# EAGLE schematic generator2 (EAGLE 6.5.0)
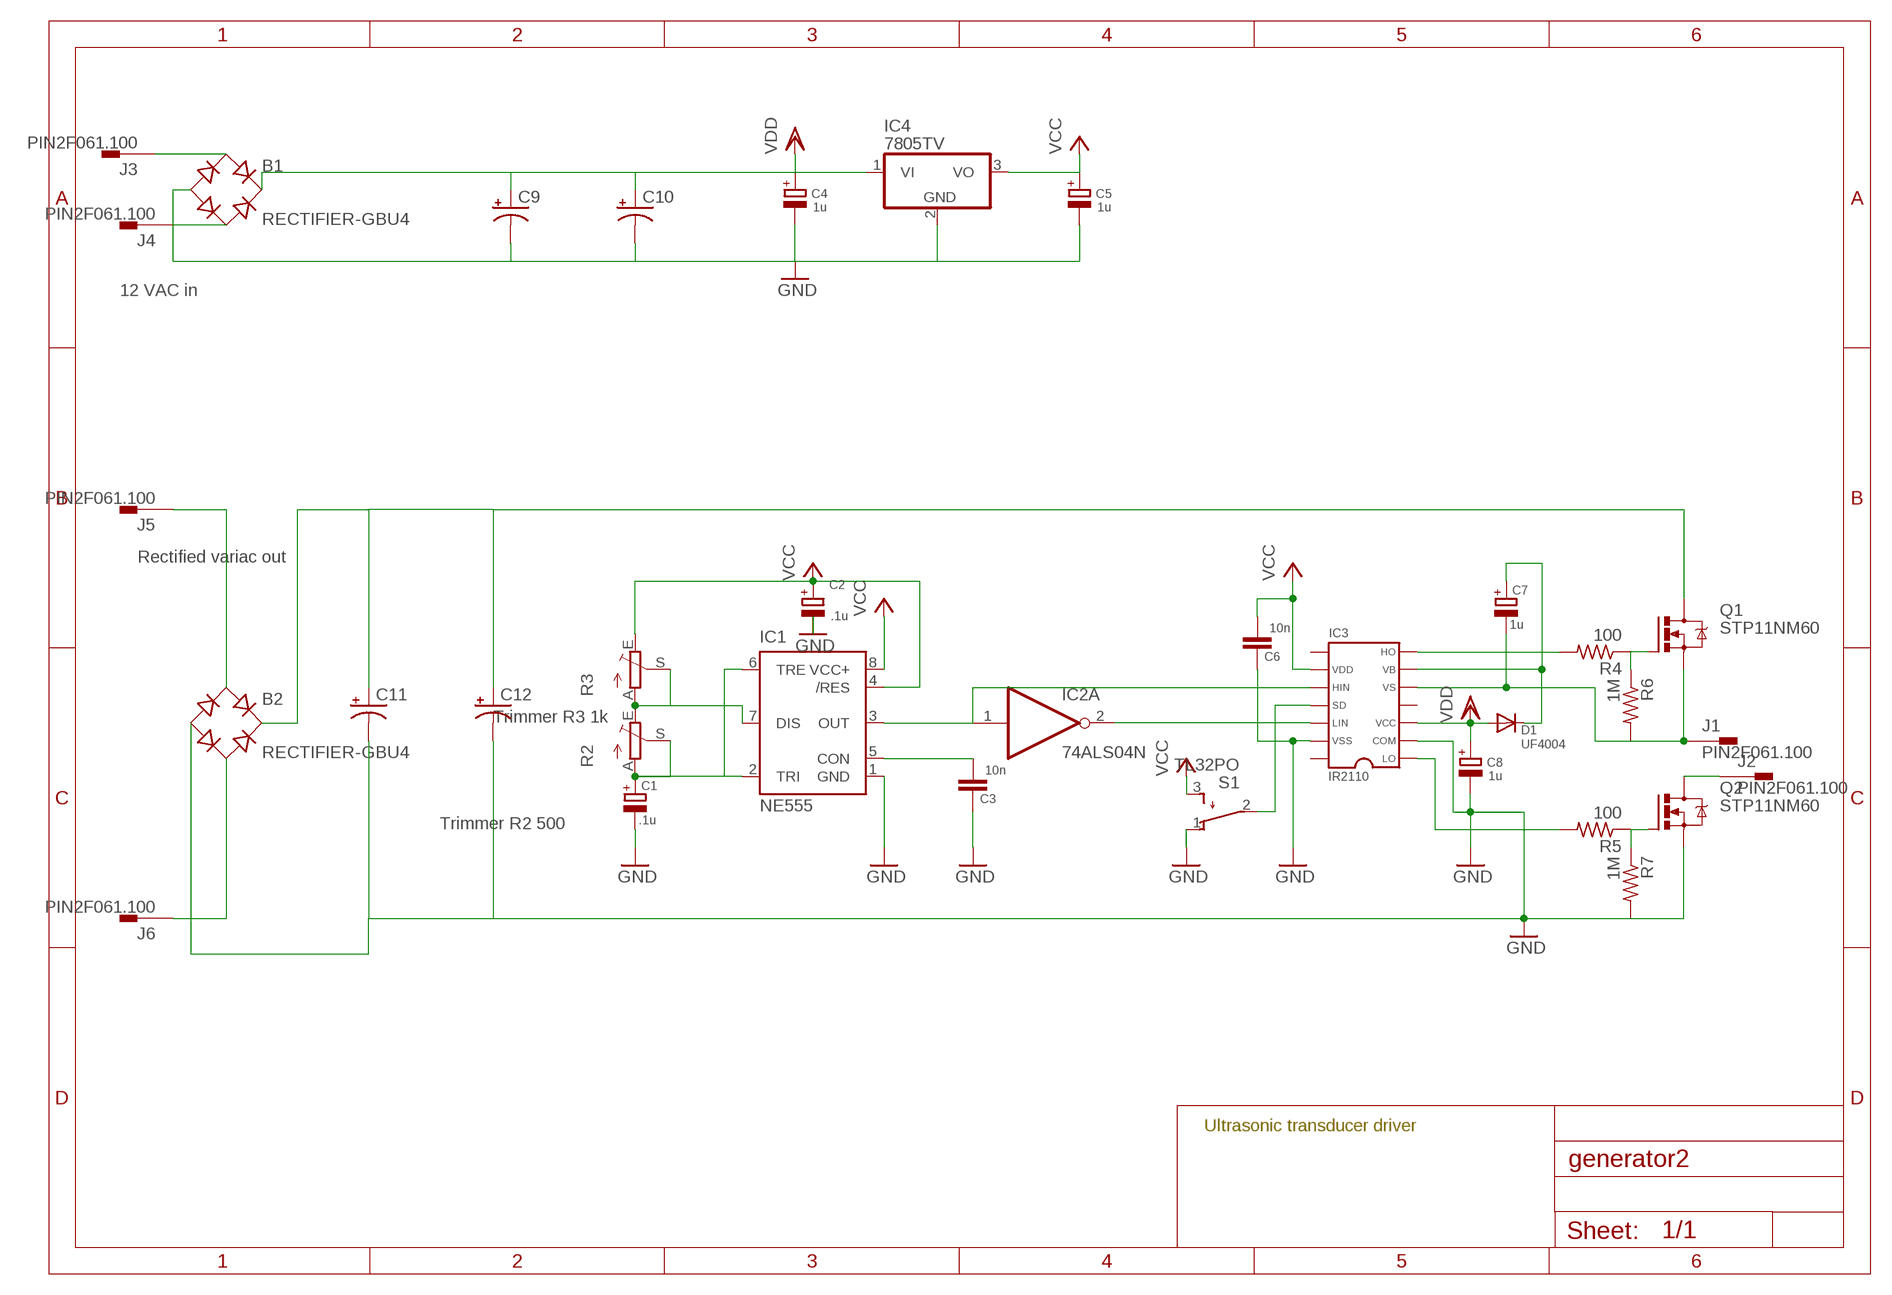
[diagram p0: schematic, sheet 1]

## Parts
B1  RECTIFIER-GBU4  [GBU4]
B2  RECTIFIER-GBU4  [GBU4]
C1  .1u  CPOL-EUE5-8.5  [E5-8,5]
C2  .1u  CPOL-EUE5-8.5  [E5-8,5]
C3  10n  C-EU075-052X106  [C075-052X106]
C4  1u  CPOL-EUE5-8.5  [E5-8,5]
C5  1u  CPOL-EUE5-8.5  [E5-8,5]
C6  10n  C-EU075-052X106  [C075-052X106]
C7  1u  CPOL-EUE5-8.5  [E5-8,5]
C8  1u  CPOL-EUE5-8.5  [E5-8,5]
C9  CPOL-USE7.5-18  [E7,5-18]
C10  CPOL-USE7.5-18  [E7,5-18]
C11  CPOL-USE7.5-18  [E7,5-18]
C12  CPOL-USE7.5-18  [E7,5-18]
D1  UF4004  DIODE-D-7.5  [D-7.5]
IC1  NE555  [DIL-08]
IC2  74ALS04N  [DIL14]
IC3  IR2110  [DIL14]
IC4  7805TV  [TO220V]
J1  PIN2F061.100  [F061.100]
J2  PIN2F061.100  [F061.100]
J3  PIN2F061.100  [F061.100]
J4  PIN2F061.100  [F061.100]
J5  PIN2F061.100  [F061.100]
J6  PIN2F061.100  [F061.100]
Q1  STP11NM60  IRF530  [TO220BV]
Q2  STP11NM60  IRF530  [TO220BV]
R2  TRIM_EU-LI10  [LI10]
R3  TRIM_EU-LI10  [LI10]
R4  100  R-US_0207/10  [0207/10]
R5  100  R-US_0207/10  [0207/10]
R6  1M  R-US_0207/10  [0207/10]
R7  1M  R-US_0207/10  [0207/10]
S1  TL32PO  [TL3XPO]

## Nets
GND: B1.- B2.- C1.- C2.- C3.1 C4.- C5.- C6.1 C8.- C9.- C10.- C11.- C12.- IC1.1(GND) IC3.2 IC3.13 IC4.2(GND) Q2.S R7.2 S1.1(O)
HIN: IC1.3(OUT) IC2.1(A:I) IC3.10
HO: IC3.7 R4.2
LIN: IC2.2(A:O) IC3.12
LO: IC3.1 R5.2
N$1: C7.+ D1.C IC3.6
N$2: C1.+ IC1.2(TRI) IC1.6(TRE) R2.A R2.S
N$3: C3.2 IC1.5(CON)
N$4: B2.AC1 J5.A1 J5.A2
N$5: B2.AC2 J6.A1 J6.A2
N$6: B2.+ C11.+ C12.+ Q1.D
N$7: IC1.7(DIS) R2.E R3.A R3.S
N$9: B1.AC2 J4.A1 J4.A2
N$10: B1.AC1 J3.A1 J3.A2
N$11: Q2.G R5.1 R7.1
N$12: Q1.G R4.1 R6.1
N$17: IC3.11 S1.2(P)
TRANS1: C7.- IC3.5 J1.A1 J1.A2 Q1.S R6.2
TRANS2: J2.A1 J2.A2 Q2.D
VCC: C2.+ C5.+ C6.2 IC1.4(/RES) IC1.8(VCC+) IC3.9 IC4.3(VO) R3.E S1.3(S)
VDD: B1.+ C4.+ C8.+ C9.+ C10.+ D1.A IC3.3 IC4.1(VI)
Unconnected: IC2.3(B:I) IC2.4(B:O) IC2.5(C:I) IC2.6(C:O) IC2.8(D:O) IC2.9(D:I) IC2.10(E:O) IC2.11(E:I) IC2.12(F:O) IC2.13(F:I) IC3.4 IC3.8 IC3.14

## Notes on the sheet
- 12 VAC in
- Rectified variac out
- Trimmer R3 1k
- Trimmer R2 500
- Ultrasonic transducer driver

## Power pins joined to a net without a drawn wire
GND: IC2.7(P:GND)
VCC: IC2.14(P:VCC)

## Library data of the parts
B1 B2 = rectifier:RECTIFIER-: Rectifier
C1 C2 C4 C5 C7 C8 = rcl:CPOL-EU: POLARIZED CAPACITOR, European symbol
C3 C6 = rcl:C-EU: CAPACITOR, European symbol
C9-C12 = resistor:CPOL-US: POLARIZED CAPACITOR, American symbol
D1 = diode:DIODE-: DIODE
IC1 = st-microelectronics:NE555: General purpose bipolar Timer; MF: Arrow Electronics; MPN: NE555N; OC_FARNELL: 1467742; OC_NEWARK: 89K1486
IC2 = 74xx-us:74*04: Hex INVERTER
IC3 = lindsay-mosfet-driver:IR2110
IC4 = linear:78*: Positive VOLTAGE REGULATOR Source: http://cache.national.com/ds/LM/LM78L05.pdf http://www.fairchildsemi.com/ds/LM/LM7805.pdf
J1-J6 = con-faston:PIN2: Flachstecker Typ Tyco/Electronics/AMP TAB, FASTON Printed Circuit Board Tabs Source: http://www.buerklin.com, http://catalog.tycoelectronics.com; OC_FARNELL: unknown; OC_NEWARK: unknown
Q1 Q2 = transistor-power:IRF530: HEXFET Power MOSFET
R2 R3 = pot:TRIM_EU-: POTENTIOMETER
R4-R7 = rcl:R-US_: RESISTOR, American symbol
S1 = switch:TL32PO: TINY SWITCH ON - MOM Source: http://www2.produktinfo.conrad.com/datenblaetter/700000-724999/705152-da-01-de-Subminiaturschalter_TL_36YO.pdf